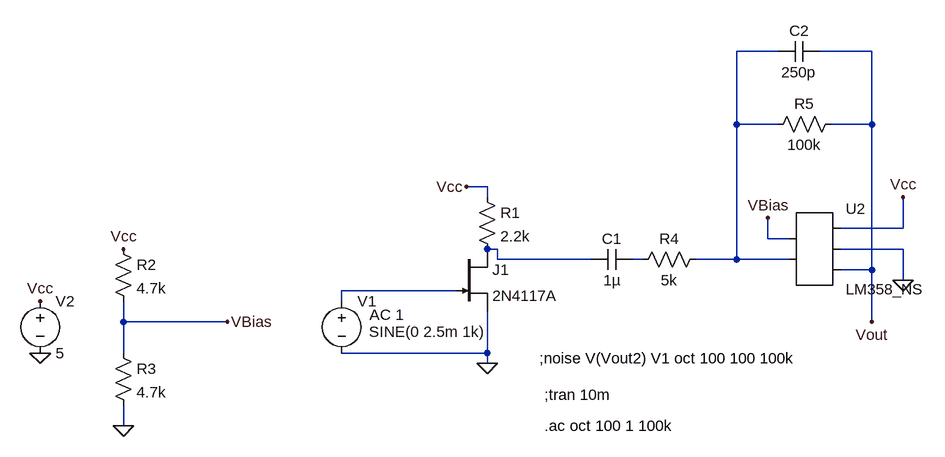
[diagram p0: schematic Building_Preamp_3_LM358_BandPass.asc]
Building_Preamp_3_LM358_BandPass.asc, the LTspice schematic file:
Version 4
SHEET 1 1540 680
WIRE 656 -240 592 -240
WIRE 800 -240 720 -240
WIRE 592 -128 592 -240
WIRE 656 -128 592 -128
WIRE 800 -128 800 -240
WIRE 800 -128 736 -128
WIRE 208 -32 176 -32
WIRE 208 -16 208 -32
WIRE 848 32 848 -16
WIRE 848 32 752 32
WIRE 640 48 640 16
WIRE 672 48 640 48
WIRE 224 64 208 64
WIRE 848 64 752 64
WIRE 224 80 224 64
WIRE 368 80 224 80
WIRE 448 80 432 80
WIRE 592 80 592 -128
WIRE 592 80 528 80
WIRE 672 80 592 80
WIRE 800 96 800 -128
WIRE 800 96 752 96
WIRE 848 112 848 64
WIRE 160 128 -16 128
WIRE -16 144 -16 128
WIRE -352 176 -352 144
WIRE -192 176 -352 176
WIRE 800 176 800 96
WIRE -352 224 -352 176
WIRE 208 224 208 160
WIRE 208 224 -16 224
WIRE 208 240 208 224
WIRE -352 336 -352 304
FLAG -480 224 0
FLAG 800 176 Vout
FLAG 208 240 0
FLAG -480 144 Vcc
FLAG -352 64 Vcc
FLAG -352 336 0
FLAG -192 176 VBias
FLAG 848 112 0
FLAG 848 -16 Vcc
FLAG 176 -32 Vcc
FLAG 640 16 VBias
SYMBOL voltage -16 128 R0
WINDOW 123 43 37 Left 2
WINDOW 39 0 0 Left 0
WINDOW 3 42 63 Left 2
SYMATTR Value2 AC 1
SYMATTR Value SINE(0 2.5m 1k)
SYMATTR InstName V1
SYMBOL voltage -480 128 R0
WINDOW 123 0 0 Left 0
WINDOW 39 0 0 Left 0
SYMATTR InstName V2
SYMATTR Value 5
SYMBOL res 192 -32 R0
SYMATTR InstName R1
SYMATTR Value 2.2k
SYMBOL cap 432 64 R90
WINDOW 0 0 32 VBottom 2
WINDOW 3 32 32 VTop 2
SYMATTR InstName C1
SYMATTR Value 1µ
SYMBOL njf 160 64 R0
SYMATTR InstName J1
SYMATTR Value 2N4117A
SYMBOL res -368 48 R0
SYMATTR InstName R2
SYMATTR Value 4.7k
SYMBOL res -368 208 R0
SYMATTR InstName R3
SYMATTR Value 4.7k
SYMBOL AutoGenerated\\LM358_NS 704 64 R0
SYMATTR InstName U2
SYMBOL res 544 64 R90
WINDOW 0 0 56 VBottom 2
WINDOW 3 32 56 VTop 2
SYMATTR InstName R4
SYMATTR Value 5k
SYMBOL res 752 -144 R90
WINDOW 0 0 56 VBottom 2
WINDOW 3 32 56 VTop 2
SYMATTR InstName R5
SYMATTR Value 100k
SYMBOL cap 720 -256 R90
WINDOW 0 0 32 VBottom 2
WINDOW 3 32 32 VTop 2
SYMATTR InstName C2
SYMATTR Value 250p
TEXT 296 288 Left 2 !;tran 10m
TEXT 288 232 Left 2 !;noise V(Vout2) V1 oct 100 100 100k
TEXT 296 336 Left 2 !.ac oct 100 1 100k

The netlist it stands for:
* Building_Preamp_3_LM358_BandPass.asc
V1 N004 0 SINE(0 2.5m 1k) AC 1
V2 Vcc 0 5
R1 Vcc N002 2.2k
C1 N003 N002 1µ
J1 N002 N004 0 2N4117A
R2 Vcc VBias 4.7k
R3 VBias 0 4.7k
* U2: LM358_NS (symbol AutoGenerated\LM358_NS not available, pins judged from their places): pin1=VBias pin2=N001 pin3=Vcc pin4=0 pin5=Vout
R4 N001 N003 5k
R5 Vout N001 100k
C2 Vout N001 250p
.model NJF NJF
.model PJF PJF
.lib standard.jft
;tran 10m
;noise V(Vout2) V1 oct 100 100 100k
.ac oct 100 1 100k
.backanno
.end